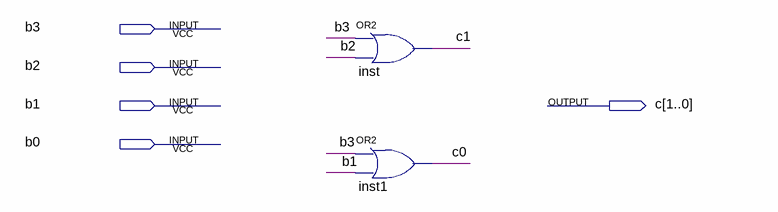
[diagram p0: schematic sheet]
// Quartus schematic abk_codif.bdf as structural Verilog: 2 symbols, 5 pins
module abk_codif (
  input  b3,
  input  b2,
  input  b1,
  input  b0,
  output [1:0] c
);

  or inst (c[1], b3, b2);
  or inst1 (c[0], b3, b1);
endmodule
